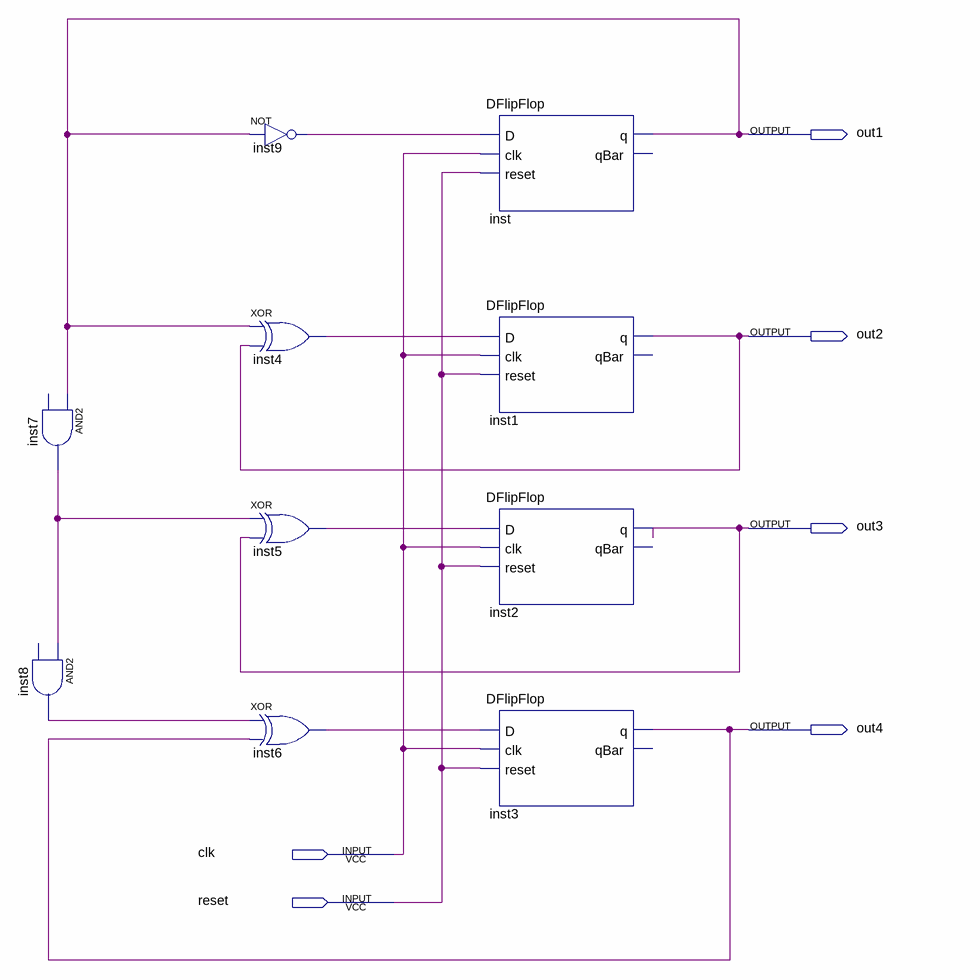
[diagram p0: schematic sheet]
// Quartus schematic SchemEntryCounter.bdf as structural Verilog: 10 symbols, 6 pins
module SchemEntryCounter (
  input  clk,
  input  reset,
  output out1,
  output out2,
  output out3,
  output out4
);

  wire inst4_out, inst5_out, inst6_out, inst7_out, inst8_out, inst9_out;

  buf inst7 (inst7_out, out1);  // AND2 open: IN2
  buf inst8 (inst8_out, inst7_out);  // AND2 open: IN2
  not inst9 (inst9_out, out1);
  xor inst4 (inst4_out, out1, out2);
  xor inst5 (inst5_out, inst7_out, out3);
  xor inst6 (inst6_out, inst8_out, out4);
  DFlipFlop inst (.D(inst9_out), .clk(clk), .reset(reset), .q(out1));  // open: qBar
  DFlipFlop inst1 (.D(inst4_out), .clk(clk), .reset(reset), .q(out2));  // open: qBar
  DFlipFlop inst2 (.D(inst5_out), .clk(clk), .reset(reset), .q(out3));  // open: qBar
  DFlipFlop inst3 (.D(inst6_out), .clk(clk), .reset(reset), .q(out4));  // open: qBar
endmodule
